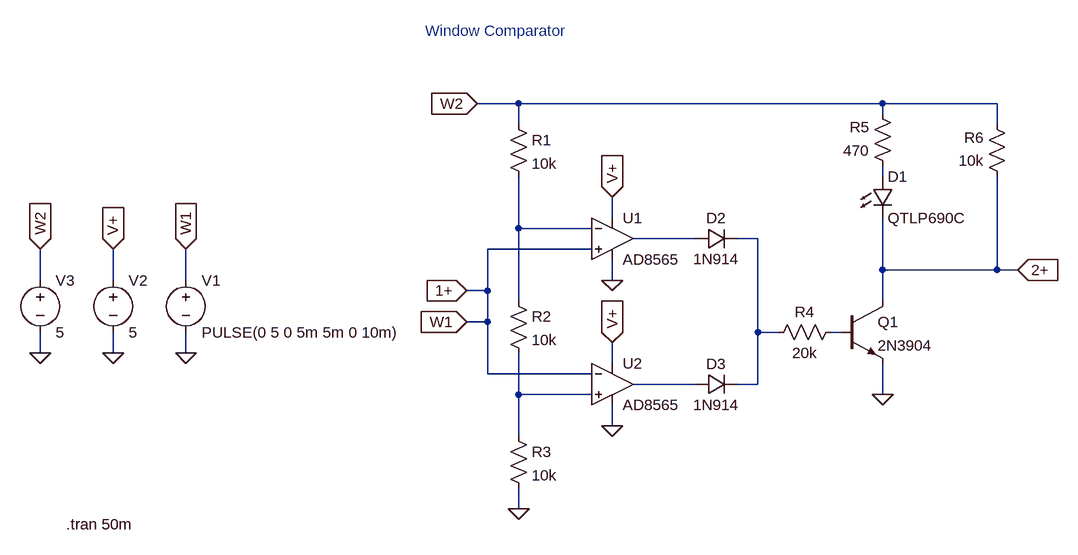
[diagram p0: schematic window_comp.asc]
window_comp.asc, the LTspice schematic file:
Version 4
SHEET 1 976 744
WIRE 64 80 0 80
WIRE 624 80 64 80
WIRE 800 80 624 80
WIRE 624 96 624 80
WIRE 64 112 64 80
WIRE 800 112 800 80
WIRE 624 192 624 176
WIRE 208 256 208 224
WIRE 64 272 64 192
WIRE 176 272 64 272
WIRE 336 288 240 288
WIRE 432 288 400 288
WIRE 176 304 16 304
WIRE 624 336 624 256
WIRE 800 336 800 192
WIRE 800 336 624 336
WIRE 832 336 800 336
WIRE -672 352 -672 304
WIRE -560 352 -560 304
WIRE -448 352 -448 304
WIRE 208 352 208 320
WIRE 16 368 16 304
WIRE 16 368 -16 368
WIRE 64 384 64 272
WIRE 624 384 624 336
WIRE 16 416 16 368
WIRE 16 416 -16 416
WIRE 432 432 432 288
WIRE 464 432 432 432
WIRE 560 432 544 432
WIRE -672 464 -672 432
WIRE -560 464 -560 432
WIRE -448 464 -448 432
WIRE 208 480 208 448
WIRE 16 496 16 416
WIRE 176 496 16 496
WIRE 336 512 240 512
WIRE 432 512 432 432
WIRE 432 512 400 512
WIRE 64 528 64 464
WIRE 176 528 64 528
WIRE 624 528 624 480
WIRE 208 576 208 544
WIRE 64 592 64 528
WIRE 64 704 64 672
FLAG 64 704 0
FLAG -448 464 0
FLAG -448 304 W1
IOPIN -448 304 In
FLAG -16 416 W1
IOPIN -16 416 In
FLAG 0 80 W2
IOPIN 0 80 In
FLAG 208 224 V+
IOPIN 208 224 In
FLAG 208 352 0
FLAG 208 576 0
FLAG 208 448 V+
IOPIN 208 448 In
FLAG 832 336 2+
IOPIN 832 336 In
FLAG 624 528 0
FLAG -560 464 0
FLAG -560 304 V+
IOPIN -560 304 In
FLAG -16 368 1+
IOPIN -16 368 In
FLAG -672 464 0
FLAG -672 304 W2
IOPIN -672 304 In
SYMBOL Opamps\\AD8565 208 224 R0
SYMATTR InstName U1
SYMBOL Opamps\\AD8565 208 448 R0
SYMATTR InstName U2
SYMBOL res 48 96 R0
SYMATTR InstName R1
SYMATTR Value 10k
SYMBOL res 48 368 R0
SYMATTR InstName R2
SYMATTR Value 10k
SYMBOL res 48 576 R0
SYMATTR InstName R3
SYMATTR Value 10k
SYMBOL res 560 416 R90
WINDOW 0 0 56 VBottom 2
WINDOW 3 32 56 VTop 2
SYMATTR InstName R4
SYMATTR Value 20k
SYMBOL res 640 192 R180
WINDOW 0 36 76 Left 2
WINDOW 3 36 40 Left 2
SYMATTR InstName R5
SYMATTR Value 470
SYMBOL res 816 208 R180
WINDOW 0 36 76 Left 2
WINDOW 3 36 40 Left 2
SYMATTR InstName R6
SYMATTR Value 10k
SYMBOL voltage -448 336 R0
WINDOW 123 0 0 Left 0
WINDOW 39 0 0 Left 0
SYMATTR InstName V1
SYMATTR Value PULSE(0 5 0 5m 5m 0 10m)
SYMBOL LED 608 192 R0
SYMATTR InstName D1
SYMATTR Value QTLP690C
SYMBOL npn 560 384 R0
SYMATTR InstName Q1
SYMATTR Value 2N3904
SYMBOL diode 336 304 R270
WINDOW 0 32 32 VTop 2
WINDOW 3 0 32 VBottom 2
SYMATTR InstName D2
SYMATTR Value 1N914
SYMBOL diode 336 528 R270
WINDOW 0 32 32 VTop 2
WINDOW 3 0 32 VBottom 2
SYMATTR InstName D3
SYMATTR Value 1N914
SYMBOL voltage -560 336 R0
WINDOW 123 0 0 Left 0
WINDOW 39 0 0 Left 0
SYMATTR InstName V2
SYMATTR Value 5
SYMBOL voltage -672 336 R0
WINDOW 123 0 0 Left 0
WINDOW 39 0 0 Left 0
SYMATTR InstName V3
SYMATTR Value 5
TEXT -80 -32 Left 2 ;Window Comparator
TEXT -632 728 Left 2 !.tran 50m

The netlist it stands for:
* window_comp.asc
XU1 1+ N002 V+ 0 N003 AD8565  ; pins In+ In- V+ V- OUT
XU2 N007 1+ V+ 0 N006 AD8565  ; pins In+ In- V+ V- OUT
R1 W2 N002 10k
R2 N002 N007 10k
R3 N007 0 10k
R4 N005 N004 20k
R5 N001 W2 470
R6 2+ W2 10k
V1 1+ 0 PULSE(0 5 0 5m 5m 0 10m)
D1 N001 2+ QTLP690C
Q1 2+ N005 0 0 2N3904
D2 N003 N004 1N914
D3 N006 N004 1N914
V2 V+ 0 5
V3 W2 0 5
.model D D
.lib standard.dio
.model NPN NPN
.model PNP PNP
.lib standard.bjt
* Window Comparator
.tran 50m
.backanno
.end